# EAGLE design atmega328-7-13-10 (EAGLE 5.06)
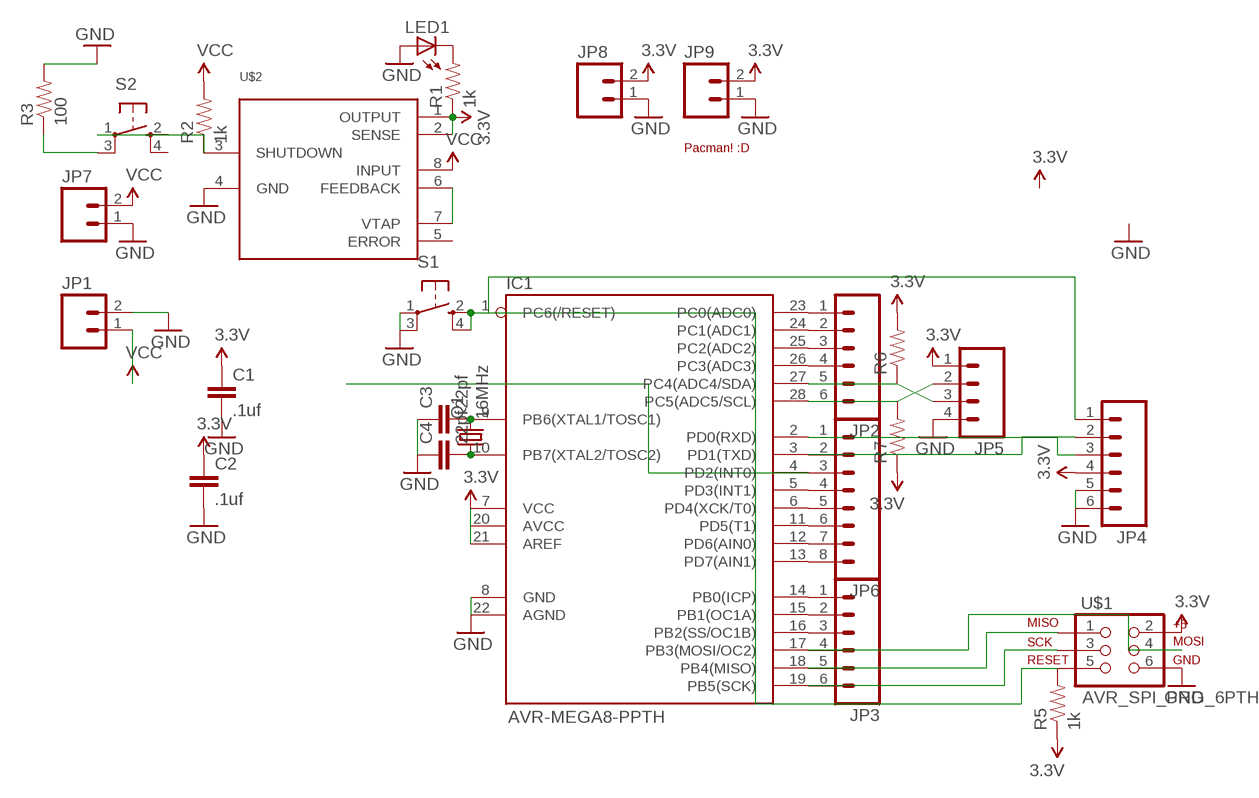
[diagram p0: schematic, sheet 1]

## Parts
C1  .1uf  CAP0603-CAP  [0603-CAP]
C2  .1uf  CAP0603-CAP  [0603-CAP]
C3  22pf  CAPPTH  [CAP-PTH-SMALL]
C4  22pf  CAPPTH  [CAP-PTH-SMALL]
IC1  AVR-MEGA8-PPTH  [DIL28-3]
JP1  M025MM  [SCREWTERMINAL-5MM-2]
JP2  M06LOCK  [1X06_LOCK]
JP3  M06LOCK  [1X06_LOCK]
JP4  M06LOCK  [1X06_LOCK]
JP5  M04LOCK  [1X04_LOCK]
JP6  M08LOCK  [1X08_LOCK]
JP7  M02LOCK  [1X02_LOCK]
JP8  M02LOCK  [1X02_LOCK]
JP9  M02LOCK  [1X02_LOCK]
LED1  LED0603  [LED-0603]
Q1  16MHz  CRYSTALHC49UV  [HC49U-V]
R1  1k  RESISTOR0603-RES  [0603-RES]
R2  1k  RESISTOR0603-RES  [0603-RES]
R3  100  RESISTOR0603-RES  [0603-RES]
R5  1k  RESISTOR0603-RES  [0603-RES]
R6  RESISTOR0603-RES  [0603-RES]
R7  RESISTOR0603-RES  [0603-RES]
S1  TAC_SWITCHSMD  [TACTILE_SWITCH_SMD]
S2  TAC_SWITCHSMD  [TACTILE_SWITCH_SMD]
U$1  AVR_SPI_PRG_6PTH  [2X3]
U$2  LP2951ACM-3.3  [SOIC-8]
U$4  PAC  [PAC]

## Nets
3.3V: C1.1 C2.1 IC1.7(VCC) IC1.20(AVCC) IC1.21(AREF) JP4.4 JP5.1 JP8.2 JP9.2 R1.1 R5.1 R6.2 R7.1 U$1.2 U$2.1(OUTPUT) U$2.2(SENSE)
GND: C1.2 C2.2 C3.1 C4.1 IC1.8(GND) IC1.22(AGND) JP1.2 JP4.5 JP4.6 JP5.4 JP7.1 JP8.1 JP9.1 LED1.A R3.2 S1.1 S1.3 U$1.6 U$2.4(GND)
N$1: IC1.23(PC0(ADC0)) JP2.1
N$2: IC1.24(PC1(ADC1)) JP2.2
N$3: IC1.25(PC2(ADC2)) JP2.3
N$4: IC1.26(PC3(ADC3)) JP2.4
N$5: IC1.27(PC4(ADC4/SDA)) JP2.5 JP5.3 R6.1
N$6: IC1.28(PC5(ADC5/SCL)) JP2.6 JP5.2 R7.2
N$7: IC1.2(PD0(RXD)) JP4.3 JP6.1
N$8: IC1.3(PD1(TXD)) JP4.2 JP6.2
N$10: IC1.5(PD3(INT1)) JP6.4
N$11: IC1.6(PD4(XCK/T0)) JP6.5
N$12: IC1.11(PD5(T1)) JP6.6
N$13: IC1.12(PD6(AIN0)) JP6.7
N$14: IC1.13(PD7(AIN1)) JP6.8
N$15: IC1.14(PB0(ICP)) JP3.1
N$16: IC1.15(PB1(OC1A)) JP3.2
N$17: IC1.16(PB2(SS/OC1B)) JP3.3
N$18: IC1.17(PB3(MOSI/OC2)) JP3.4 U$1.4
N$19: IC1.18(PB4(MISO)) JP3.5 U$1.1
N$20: IC1.19(PB5(SCK)) JP3.6 U$1.3
N$21: IC1.1(PC6(/RESET)) JP4.1 R5.2 S1.2 S1.4 U$1.5
N$22: U$2.6(FEEDBACK) U$2.7(VTAP)
N$23: LED1.C R1.2
N$24: C3.2 IC1.9(PB6(XTAL1/TOSC1)) Q1.2
N$25: R2.1 S2.1 S2.2 U$2.3(SHUTDOWN)
N$26: IC1.4(PD2(INT0)) JP6.3
N$27: C4.2 IC1.10(PB7(XTAL2/TOSC2)) Q1.1
N$31: R3.1 S2.3
VCC: JP1.1 JP7.2 R2.2 U$2.8(INPUT)
Unconnected: S2.4 U$2.5(ERROR)

## Library data of the parts
C1 C2 = joshashby:CAP: Standard 0603 ceramic capacitor
C3 C4 = SparkFun:CAP: Capacitor Standard 0603 ceramic capacitor, and 0.1" leaded capacitor.
IC1 = joshashby:AVR-MEGA8-P
JP1 JP7-JP9 = joshashby:M02: Standard 2-pin 0.1" header
JP2-JP4 = joshashby:M06: Standard 6-pin 0.1" header
JP5 = joshashby:M04: Standard 4-pin 0.1" Header
JP6 = joshashby:M08: Standard 8-pin 0.1" header
LED1 = joshashby:LED: 0603 sized LED
Q1 = SparkFun:CRYSTAL: Crystals Various standard crystals. Proven footprints. Spark Fun Electronics SKU : COM-00534
R1-R3 R5-R7 = joshashby:RESISTOR: 0603
S1 S2 = joshashby:TAC_SWITCH: Momentary Switch Button commonly used for reset or general input. Spark Fun Electronics SKU : COM-00097
U$1 = joshashby:AVR_SPI_PRG_6: This is the reduced ISP connector for AVR programming
U$2 = joshashby:LP2951ACM-3.3: LP2951 3.3V 100mA low drop out, accurate (.5% tolerance) regulator from National Semi in the SOIC-8 package with the Sense, Feedback, Error, Shutdown and V-Tap pins broken out.
U$4 = joshashby:PAC: Pacman! :D

## Board
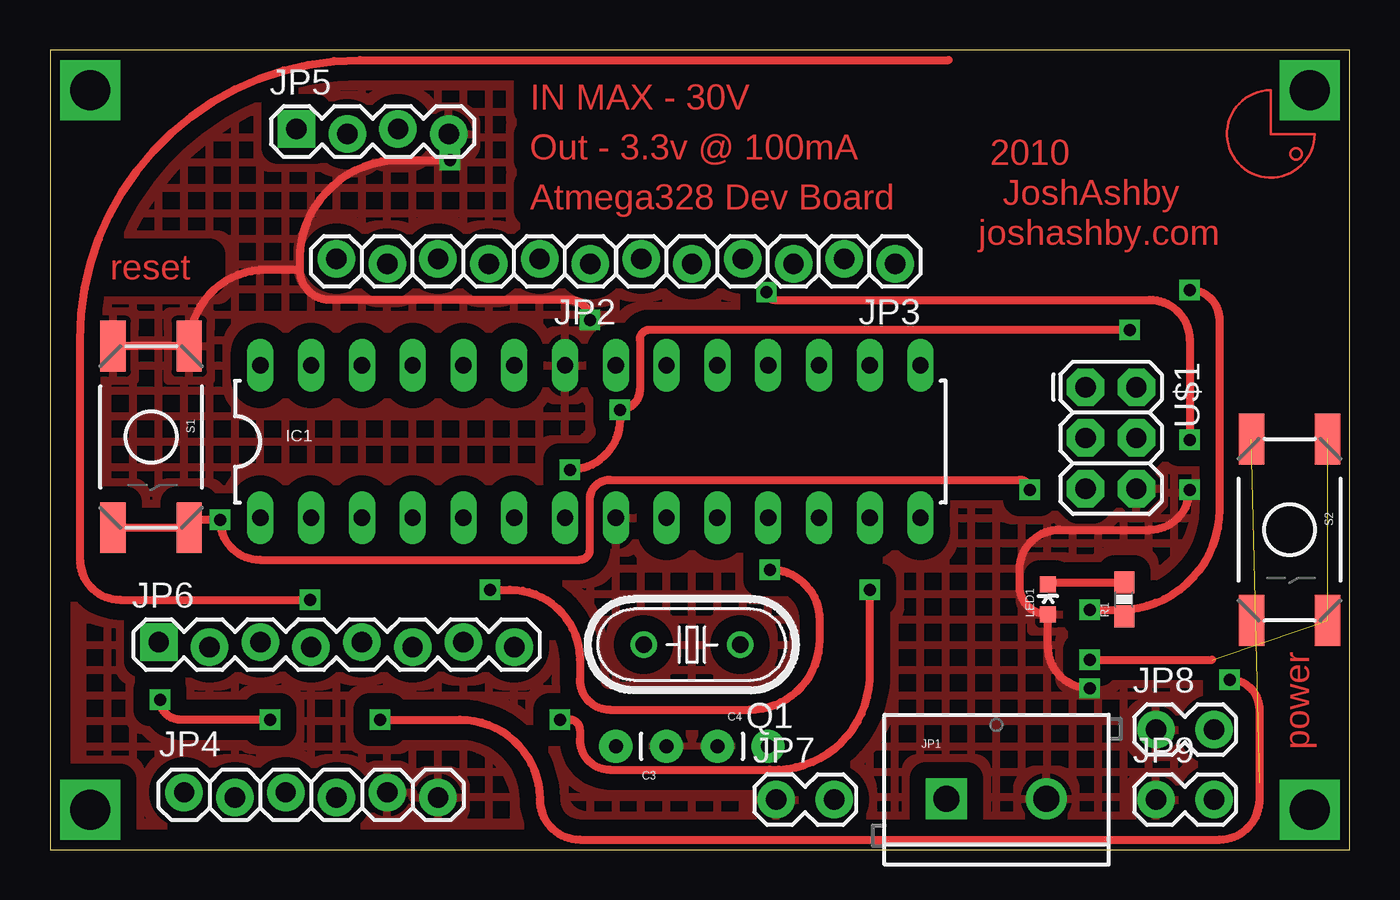
[diagram p1: board, top side]
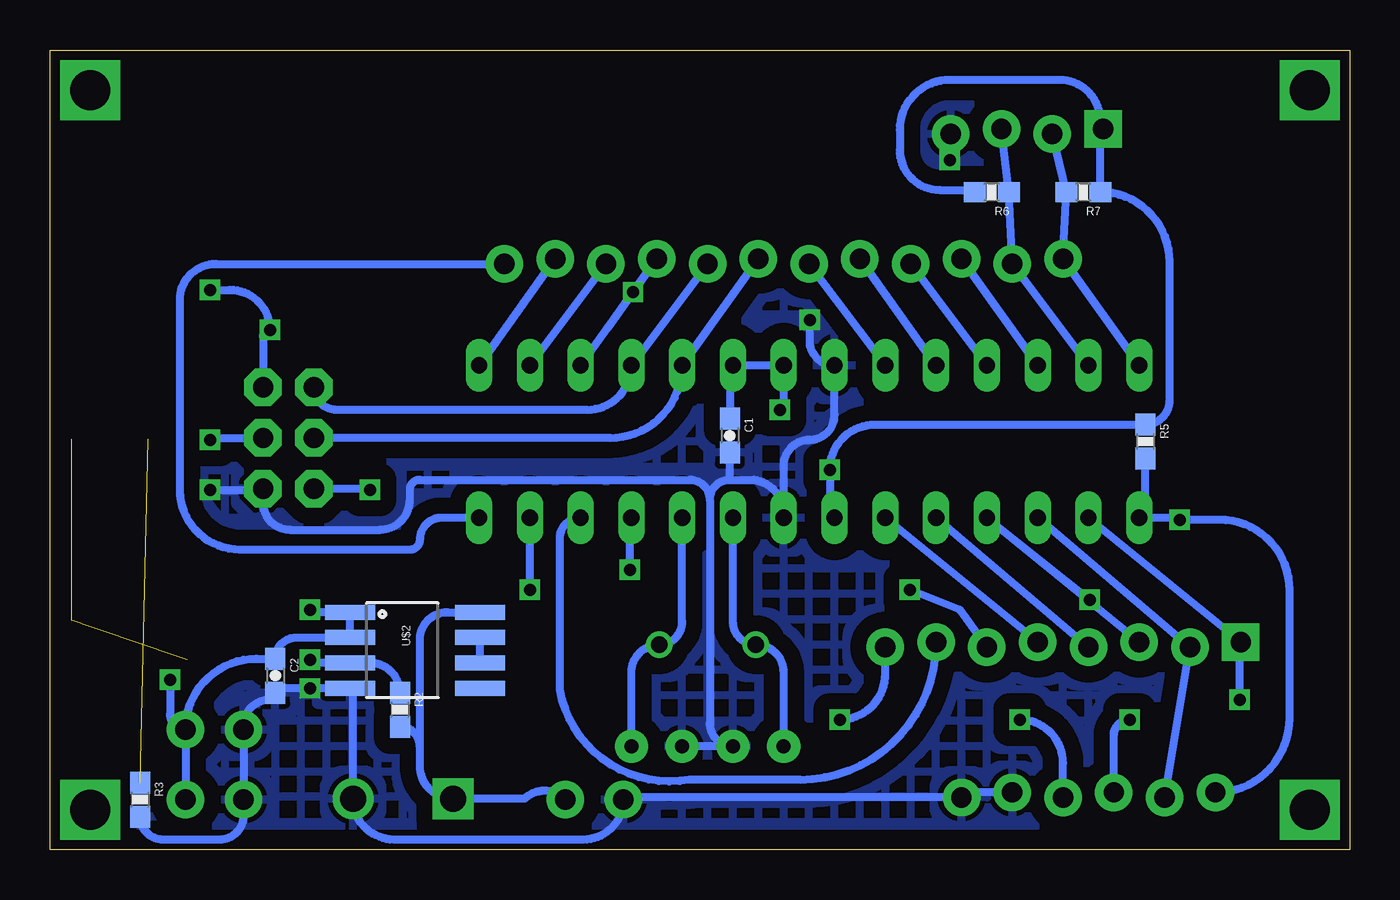
[diagram p2: board, bottom side, seen from below]

Size 65 x 40 mm. Coordinates in mm from the lower left corner, seen from the top.
Outline: 0,0 65,0 65,40 0,40 0,0
Copper layers (1*16): Top 0.035mm / dielectric 1.5mm / Bottom 0.035mm
Design rules "default": minimum track width 10mil, minimum drill 24mil, track to track 8mil, track to pad 8mil, pad to pad 8mil, via to via 8mil, smd to smd 8mil, copper to edge 40mil, drill to drill 8mil, minimum pad ring 10mil, minimum via ring 8mil, stop-mask expansion 4mil, vias tented up to drill 0mil, thermal gap 10mil

### Footprints (pad centres in the part's own frame; a part is rotated, then mirrored left to right if it is on the bottom)
0603-CAP = smd 1.1 x 1: 1 -0.85,0; 2 0.85,0
CAP-PTH-SMALL = drill 0.7 pad 1.651 round: 1 0,0; 2 2.54,0
DIL28-3 = drill 0.813 long: 1 -16.51,-3.81; 2 -13.97,-3.81; 3 -11.43,-3.81; 4 -8.89,-3.81; 5 -6.35,-3.81; 6 -3.81,-3.81; 7 -1.27,-3.81; 8 1.27,-3.81; 9 3.81,-3.81; 10 6.35,-3.81; 11 8.89,-3.81; 12 11.43,-3.81; 13 13.97,-3.81; 14 16.51,-3.81; 15 16.51,3.81; 16 13.97,3.81; 17 11.43,3.81; 18 8.89,3.81; 19 6.35,3.81; 20 3.81,3.81; 21 1.27,3.81; 22 -1.27,3.81; 23 -3.81,3.81; 24 -6.35,3.81; 25 -8.89,3.81; 26 -11.43,3.81; 27 -13.97,3.81; 28 -16.51,3.81
SCREWTERMINAL-5MM-2 = drill 1.3 pad 2.032 square: 1 0,0 | drill 1.3 pad 2.032 round: 2 5,0
1X06_LOCK = drill 1.016 pad 1.88 round: 1 0,0; 2 2.54,-0.254; 3 5.08,0; 4 7.62,-0.254; 5 10.16,0; 6 12.7,-0.254
1X04_LOCK = drill 1.016 pad 1.88 square: 1 0,0.127 | drill 1.016 pad 1.88 round: 2 2.54,-0.127; 3 5.08,0.127; 4 7.62,-0.127
1X08_LOCK = drill 1.016 pad 1.88 square: 1 0,0.127 | drill 1.016 pad 1.88 round: 2 2.54,-0.127; 3 5.08,0.127; 4 7.62,-0.127; 5 10.16,0.127; 6 12.7,-0.127; 7 15.24,0.127; 8 17.78,-0.127
1X02_LOCK = drill 1.016 pad 1.88 round: 1 -0.178,0; 2 2.718,0
LED-0603 = smd 0.8 x 0.8: A 0,-0.75; C 0,0.75
HC49U-V = drill 0.813 round: 1 -2.413,0; 2 2.413,0
0603-RES = smd 1.1 x 1: 1 -0.85,0; 2 0.85,0
TACTILE_SWITCH_SMD = smd 2.54 x 1.27: 1 -6.54,1.905; 2 2.54,1.905; 3 -6.54,-1.905; 4 2.54,-1.905
2X3 = drill 1.016 pad 1.88 octagon: 1 0,0; 2 0,2.54; 3 2.54,0; 4 2.54,2.54; 5 5.08,0; 6 5.08,2.54
SOIC-8 = smd 0.75 x 2.5: 1 -1.905,-2.616; 2 -0.635,-2.616; 3 0.635,-2.616; 4 1.905,-2.616; 5 1.905,3.886; 6 0.635,3.886; 7 -0.635,3.886; 8 -1.905,3.886

### Placement (x,y rotation side)
C1  31,20.71 270 bottom
C2  53.73,8.7 270 bottom
C3  30.84,5.17 180 top
C4  33.38,5.17 0 top
IC1  27.03,20.41 0 top
JP1  44.84,2.54 0 top
JP2  27.03,29.3 180 top
JP3  42.27,29.3 180 top
JP4  6.71,2.86 0 top
JP5  12.33,35.92 0 top
JP6  5.44,10.25 0 top
JP7  36.5,2.5 0 top
JP8  55.5,6 0 top
JP9  55.5,2.5 0 top
LED1  49.92,12.51 0 top
Q1  32.11,10.25 180 top
R1  53.73,12.51 90 top
R2  47.5,7 270 bottom
R3  60.5,2.5 270 bottom
R5  10.21,20.41 270 bottom
R6  17.9,32.89 180 bottom
R7  13.32,32.89 180 bottom
S1  5.06,18.64 270 top
S2  62,14 270 top
U$1  51.8,23.13 270 top
U$2  47.38,9.97 270 bottom
U$4  61.06,35.8 270 top

### Tracks (layer width: path | path; a pad name or v marks a point on that pad's centre or on a via)
3.3V  (via drill 0.6)
  Top 0.406: 53.39,12 arc-90 R1.1 | v52,12 53.39,12 | v26,19 arc90 28.5,21.5 v28.5,22 arc90 29.5,23 29.5,25.5 arc-90 30,26 v54,26 | 53.39,12 53.5,12 arc90 58.5,17 58.5,26.5 arc90 v57,28 | v16.5,6.5 20.5,6.5 arc-90 24.5,2.5 arc90 26.5,0.5 58.5,0.5 arc90 60.5,2.5 60.5,7 arc90 v59,8.5
  Bottom 0.406: v52,12 arc-90 51.88,11.88 U$2.1 U$2.2 52.67,10.6 arc-90 C2.1 54.67,9.55 arc-90 JP8.2 | C1.1 31,24.06 arc90 IC1.20 IC1.21 28.3,22.2 arc90 v28.5,22 | IC1.7 arc90 26,16.84 v26,19 arc90 23.74,21.26 R5.1 arc-90 9,22.47 9,29.42 arc-90 R7.1 | U$1.2 54.34,25.66 arc90 v54,26 arc-90 56,28 v57,28 | R7.1 12.47,35.91 arc90 JP5.1 | R7.1 12.47,36.47 arc-90 14.5,38.5 20,38.5 arc-90 22.5,36 22.5,35 arc-90 20.5,33 18.86,33 arc90 R6.2 | JP8.2 JP9.2 | JP4.4 14.33,4.33 arc-90 v16.5,6.5 | v59,8.5 59,6.78 arc-90 JP8.2
GND  (via drill 0.6)
  Top 0.406: v52,8.07 arc-90 49.92,10.14 LED1.A arc-90 48.5,13.18 48.5,14 arc-90 50.5,16 55,16 arc90 v57,18 | v20,34.5 17.5,34.5 arc90 12.5,29.5 12.5,29 | 12.5,29 arc90 14,27.5 26,27.5 arc-90 v27,26.5 | S1.3 S1.1 arc-90 10.78,29 12.5,29
  Bottom 0.406: JP5.4 19.95,34.55 arc90 v20,34.5 | v27,26.5 27,25.46 arc-90 IC1.22 25.76,21.74 arc90 27,20.5 arc-90 28.3,19.2 28.3,16.5 | 28.3,16.5 IC1.8 | C4.1 C3.1 arc90 32,6.33 32,17.5 | 32,17.5 arc90 31,18.5 | 31,18.5 29.8,18.5 arc90 28.3,16.5 | 31,18.5 C1.2 | 32,17.5 arc-90 33,18.5 46.5,18.5 arc-90 47,18 47,17.5 arc90 48.5,16 53,16 arc90 54.34,17.34 U$1.6 arc90 54.39,18 v57,18 | R3.2 arc-90 59.35,0.5 56.5,0.5 arc-90 55.32,1.68 JP9.1 JP8.1 55.32,6.18 arc90 54,7.5 54,7.58 arc90 C2.2 arc90 53.52,8.07 v52,8.07 U$2.4 arc90 49.84,7.91 JP1.2 arc-90 47.8,0.5 38.32,0.5 arc-90 JP7.1 arc90 36.22,2.61 JP4.6 arc90 19.16,2.86 JP4.5
  pour Top (isolate 0.813, hatched): 0,40 65,40 65,0 0,0
  pour Bottom (isolate 0.813, hatched): 0,40 65,40 65,0 0,0
N$1
  Bottom 0.406: IC1.23 JP2.1
N$2
  Bottom 0.406: IC1.24 JP2.2
N$3
  Bottom 0.406: IC1.25 JP2.3
N$4
  Bottom 0.406: IC1.26 JP2.4
N$5
  Bottom 0.406: JP5.3 R6.1 JP2.5 IC1.27
N$6
  Bottom 0.406: IC1.28 JP2.6 R7.2 JP5.2
N$7  (via drill 0.6)
  Top 0.406: v11,6.5 6.5,6.5 arc-90 v5.5,7.5
  Bottom 0.406: IC1.2 JP6.1 arc-90 5.5,10.32 v5.5,7.5 | JP4.3 11.79,5.71 arc90 v11,6.5
N$8
  Bottom 0.406: IC1.3 JP6.2 JP4.2
N$9  (via drill 2 pad 2.18)
  other vias: 2,38
N$10
  Bottom 0.406: JP6.4 IC1.5
N$11
  Bottom 0.406: JP6.5 IC1.6
N$12  (via drill 0.6)
  Top 0.406: v22,13 23,13 arc-90 26.5,9.5 26.5,8.5 arc90 28,7 35,7 arc90 38.5,10.5 38.5,11.5 arc90 v36,14
  Bottom 0.406: JP6.6 19.5,12 v22,13 | v36,14 36,16.52 arc90 IC1.11
N$13
  Bottom 0.406: JP6.7 20.68,10.32 arc90 27.5,3.5 33,3.5 arc90 39.5,8 39.5,15.56 arc90 IC1.12
N$14  (via drill 0.6)
  Top 0.406: v25.5,6.5 26,6.5 arc-90 26.5,6 26.5,5.5 arc90 28,4 36,4 arc90 41,8.5 v41,13
  Bottom 0.406: JP6.8 23.22,8.78 arc90 v25.5,6.5 | v41,13 IC1.13
N$15
  Bottom 0.406: IC1.14 45.4,16.6 arc-90 46.5,15.5 arc90 47,15 55.5,15 arc90 58.5,18 58.5,27.5 arc90 56.7,29.3 JP3.1
N$16
  Bottom 0.406: JP3.2 IC1.15
N$17
  Bottom 0.406: JP3.3 IC1.16
N$18  (via drill 0.6)
  Top 0.406: v57,20.5 57,25.5 arc90 55,27.5 36.23,27.5 arc-90 v35.84,27.89
  Bottom 0.406: JP3.4 v35.84,27.89 37.12,26.09 IC1.17 | U$1.4 56.91,20.59 arc-90 v57,20.5
N$19
  Bottom 0.406: JP3.5 IC1.18 arc90 38.14,22 50.67,22 arc90 U$1.1
N$20
  Bottom 0.406: JP3.6 IC1.19 arc90 37.01,20.59 U$1.3
N$21  (via drill 0.6)
  Top 0.406: S1.4 S1.2 arc-90 7.36,16.5 v8.5,16.5 arc90 10.5,14.5 26.5,14.5 arc90 27,15 27,17.5 arc-90 28,18.5 48.5,18.5 arc-90 v49,18
  Bottom 0.406: R5.2 10.21,16.91 arc90 IC1.1 8.6,16.6 arc90 v8.5,16.5 6.5,16.5 arc90 3,13 3,6.57 arc90 JP4.1 | U$1.5 49.05,18.05 arc90 v49,18
N$22
  Bottom 0.406: U$2.6 U$2.7
N$23
  Top 0.406: LED1.C arc-90 50.02,13.36 R1.2
N$24
  Bottom 0.406: C3.2 28.3,8.85 arc-90 Q1.2 arc90 30.84,11.39 IC1.9
N$25  (via drill 0.6)  (2 unrouted)
  Top 0.406: v52,9.5 58.14,9.5
  Bottom 0.406: R2.1 arc-90 48.98,9.34 U$2.3 51.83,9.34 arc90 v52,9.5
N$26  (via drill 0.6)
  Top 0.406: v13,12.5 3.5,12.5 arc-90 1.5,14.5 1.5,25.5 arc-90 15.5,39.5 44.94,39.5
  Bottom 0.406: JP6.3 IC1.4 v13,12.5
N$27
  Bottom 0.406: IC1.10 33.38,11.39 arc90 Q1.1 arc-90 35.92,8.85 C4.2
N$28  (via drill 2 pad 2.18)
  other vias: 2,2
N$29  (via drill 2 pad 2.18)
  other vias: 63,2
N$30  (via drill 2 pad 2.18)
  other vias: 63,38
N$31  (1 unrouted)
VCC
  Bottom 0.406: 46.5,4.2 arc-90 JP1.1 41.26,2.54 arc90 JP7.2 | 46.5,4.2 46.5,10.5 arc90 45.12,11.88 U$2.8 | R2.2 arc90 46.5,5.15 46.5,4.2

### Text on the board
Top: IN MAX - 30V | 2010 | Out - 3.3v @ 100mA | JoshAshby | Atmega328 Dev Board | joshashby.com | reset | power